# EAGLE design rover (EAGLE 9.6.2)
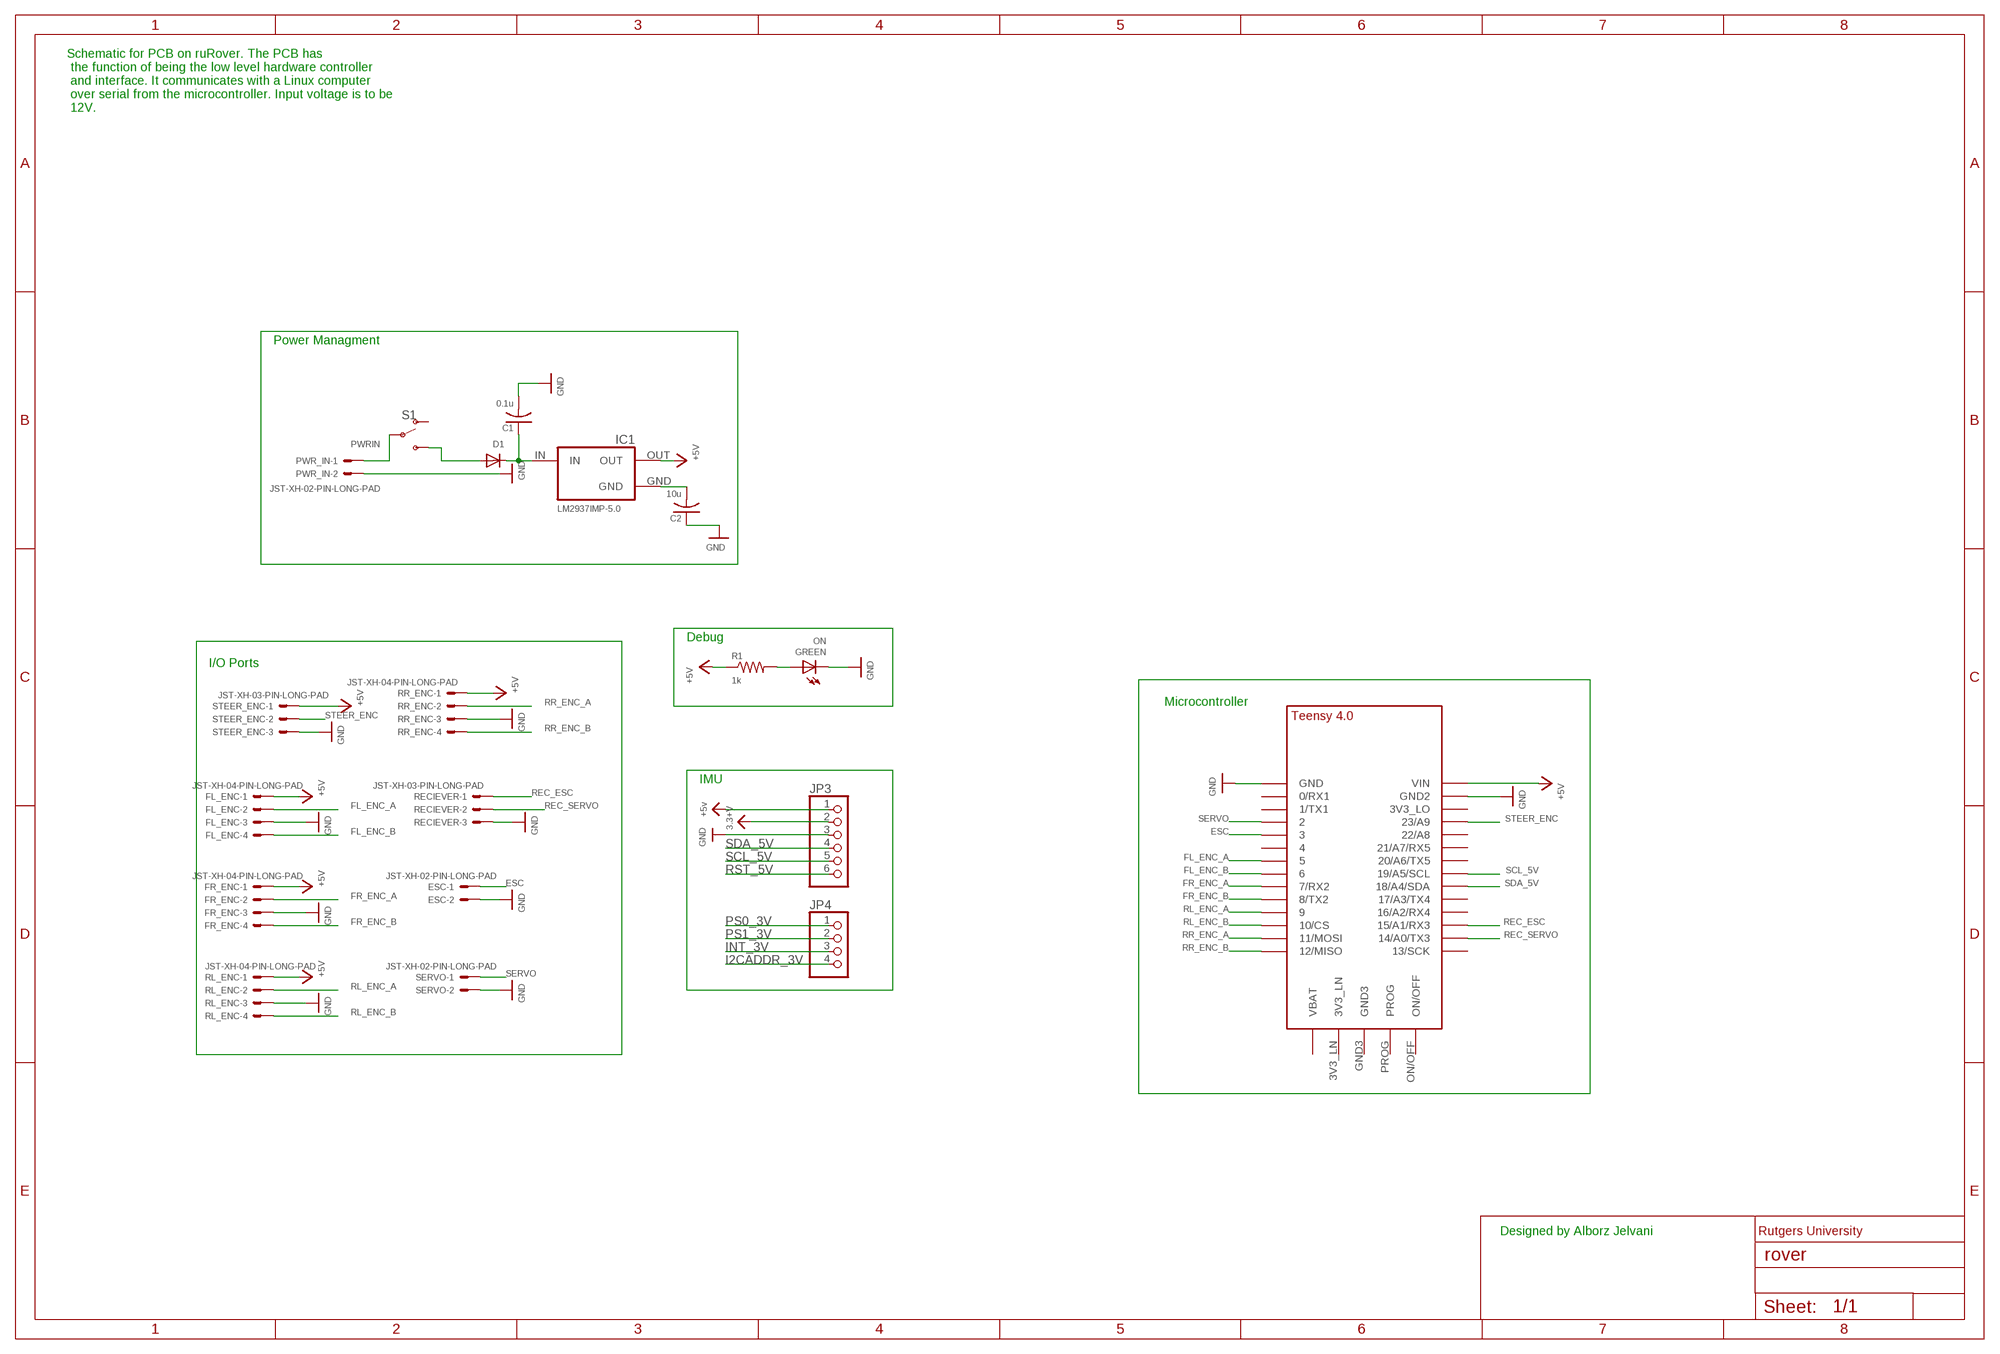
[diagram p0: schematic, sheet 1]

## Parts
C1  0.1u  C-USC1206  [C1206]
C2  10u  C-USC1206  [C1206]
D1  DIODESMA  [SMADIODE]
ESC  JST-XH-02-PIN-LONG-PAD  [JST-XH-02-PACKAGE-LONG-PAD]
FL_ENC  JST-XH-04-PIN-LONG-PAD  [JST-XH-04-PACKAGE-LONG-PAD]
FR_ENC  JST-XH-04-PIN-LONG-PAD  [JST-XH-04-PACKAGE-LONG-PAD]
GREEN  ON  LEDCHIP-LED0805  [CHIP-LED0805]
IC1  LM2937IMP-5.0  [SOT223]
JP3  HEADER-1X676MIL  [1X06_ROUND_76]
JP4  HEADER-1X476MIL  [1X04_ROUND_76]
PWR_IN  JST-XH-02-PIN-LONG-PAD  [JST-XH-02-PACKAGE-LONG-PAD]
R1  1k  R-US_R0603  [R0603]
RECIEVER  JST-XH-03-PIN-LONG-PAD  [JST-XH-03-PACKAGE-LONG-PAD]
RL_ENC  JST-XH-04-PIN-LONG-PAD  [JST-XH-04-PACKAGE-LONG-PAD]
RR_ENC  JST-XH-04-PIN-LONG-PAD  [JST-XH-04-PACKAGE-LONG-PAD]
S1  SWITCH-SPDT-SMD-AYZ0202  [SWITCH_DPDT_SMD_AYZ0202]
SERVO  JST-XH-02-PIN-LONG-PAD  [JST-XH-02-PACKAGE-LONG-PAD]
STEER_ENC  JST-XH-03-PIN-LONG-PAD  [JST-XH-03-PACKAGE-LONG-PAD]
U$5  TEENSY_4.0-BASIC  [TEENSY_4.0-BASIC]

## Nets
+3.3V: JP3.2 ; supply symbol labelled 3.3+V
+5V: FL_ENC.1 FR_ENC.1 IC1.OUT JP3.1 R1.1 RL_ENC.1 RR_ENC.1 STEER_ENC.1 U$5.VIN ; supply symbol labelled +5v
ESC: ESC.1 U$5.3/CANTX
FL_ENC_A: FL_ENC.2 U$5.5
FL_ENC_B: FL_ENC.4 U$5.6
FR_ENC_A: FR_ENC.2 U$5.7(7/RX2)
FR_ENC_B: FR_ENC.4 U$5.8(8/TX2)
GND: C1.2 C2.1 ESC.2 FL_ENC.3 FR_ENC.3 GREEN.C JP3.3 PWR_IN.2 RECIEVER.3 RL_ENC.3 RR_ENC.3 SERVO.2 STEER_ENC.3 U$5.GND U$5.GND2
I2CADDR_3V: JP4.4
INT_3V: JP4.3
N$1: GREEN.A R1.2
N$2: C1.1 D1.C IC1.IN
N$3: D1.A S1.3(S)
N$9: C2.2 IC1.GND
PS0_3V: JP4.1
PS1_3V: JP4.2
PWRIN: PWR_IN.1 S1.2(P)
REC_ESC: RECIEVER.1 U$5.15/A1(15/A1/RX3)
REC_SERVO: RECIEVER.2 U$5.14/A0(14/A0/TX3)
RL_ENC_A: RL_ENC.2 U$5.9/CS
RL_ENC_B: RL_ENC.4 U$5.10/CS
RR_ENC_A: RR_ENC.2 U$5.11/MOSI
RR_ENC_B: RR_ENC.4 U$5.12/MISO
RST_5V: JP3.6
SCL_5V: JP3.5 U$5.19/A5/SCL
SDA_5V: JP3.4 U$5.18/A4/SDA
SERVO: SERVO.1 U$5.2
STEER_ENC: STEER_ENC.2 U$5.23/A9
Unconnected: S1.1(O) U$5.0/RX(0/RX1) U$5.1/TX(1/TX1) U$5.3V3_LN U$5.3V3_LO U$5.4/CANRX U$5.13/SCK U$5.16/A2(16/A2/RX4) U$5.17/A3(17/A3/TX4) U$5.20/A6(20/A6/TX5) U$5.21/A7(21/A7/RX5) U$5.22/A8 U$5.GND3 U$5.ON/OFF U$5.PROG U$5.VBAT\(VBAT)

## Notes on the sheet
- Schematic for PCB on ruRover. The PCB has
   the function of being the low level hardware controller
   and interface. It communicates with a Linux computer
   over serial from the microcontroller. Input voltage is to be
   12V.
- Power Managment
- Debug
- I/O Ports
- Microcontroller
- IMU
- Designed by Alborz Jelvani | Rutgers University

## Power pins joined to a net without a drawn wire
GND: IC1.GND@(GND)

## Library data of the parts
C1 C2 = adafruit:C-US: CAPACITOR, American symbol; OC_NEWARK: unknown
D1 = adafruit:DIODE: Diode SMADIODE - SMA Surface Mount Package 20V 1A Schottky Diode Digikey: 641-1014-6-ND DO-1N4148 - Through Hole Small Current Diode SOD-123 20V 1 A (.5mV Vf) Schottky Diode - Digikey: MBRX120TPMSCT-ND SOD-323 10V 570mA (.38mV Vf, 3ns) Schottky Diode - Digikey: ZLLS410CT-ND SOD-523 30V 30mA Schottky Diode (RB751S-40TE61) - Digikey: RB751S-40TE61CT-ND SOT23-R/W - SOT23 Package (R = Solder Paste/Reflow Ovens, W = Hand-Soldering) BAT54Film 40V 300mA - Digikey: 497-7162-1-ND; OC_NEWARK: unknown
ESC PWR_IN SERVO = Rembrandt Electronics - JST XH Connectors v1-0:JST-XH-02-PIN: JST XH Connector 2 Pin Wire to board connector. Pitch: 2,54 mm, (0.100") Number of pins: 2 Created by Rembrandt Electronics www.rembrandtelectronics.com
FL_ENC FR_ENC RL_ENC RR_ENC = Rembrandt Electronics - JST XH Connectors v1-0:JST-XH-04-PIN: JST XH Connector 2 Pin Wire to board connector. Pitch: 2,54 mm, (0.100") Number of pins: 4 Created by Rembrandt Electronics www.rembrandtelectronics.com
GREEN = adafruit:LED: LED OSRAM: - CHIPLED LG R971, LG N971, LY N971, LG Q971, LY Q971, LO R971, LY R971 LH N974, LH R974 LS Q976, LO Q976, LY Q976 LO Q996 - Hyper CHIPLED LW Q18S LB Q993, LB Q99A, LB R99A - SideLED LS A670, LO A670, LY A670, LG A670, LP A670 LB A673, LV A673, LT A673, LW A673 LH A674 LY A675 LS A676, LA A676, LO A676, LY A676, LW A676 LS A679, LY A679, LG A679 - Hyper Micro SIDELED® LS Y876, LA Y876, LO Y876, LY Y876 LT Y87S - SmartLED LW L88C, LW L88S LB L89C, LB L89S, LG L890 LS L89K, LO L89K, LY L89K LS L896, LA L896, LO L896, LY L896 - TOPLED LS T670, LO T670, LY T670, LG T670, LP T670 LSG T670, LSP T670, LSY T670, LOP T670, LYG T670 LG T671, LOG T671, LSG T671 LB T673, LV T673, LT T673, LW T673 LH T674 LS T676, LA T676, LO T676, LY T676, LB T676, LH T676, LSB T676, LW T676 LB T67C, LV T67C, LT T67C, LS T67K, LO T67K, LY T67K, LW E67C LS E67B, LA E67B, LO E67B, LY E67B, LB E67C, LV E67C, LT E67C LW T67C LS T679, LY T679, LG T679 LS T770, LO T770, LY T770, LG T770, LP T770 LB T773, LV T773, LT T773, LW T773 LH T774 LS E675, LA E675, LY E675, LS T675 LS T776, LA T776, LO T776, LY T776, LB T776 LHGB T686 LT T68C, LB T68C - Hyper Mini TOPLED® LB M676 - Mini TOPLED Santana® LG M470 LS M47K, LO M47K, LY M47K Source: http://www.osram.convergy.de/; OC_NEWARK: unknown
IC1 = lm2937:LM2937IMP-*: 400 and 500 mA Low Dropout Voltage Regulator NATIONAL SEMICONDUCTOR created by Peter.Hofmann@ph-tronic.de <mailto:Reter.Hofmann@ph-tronic.de> 10-2004 Rev.0
JP3 = microbuilder:HEADER-1X6: PIN HEADER; OC_NEWARK: unknown
JP4 = microbuilder:HEADER-1X4: PIN HEADER; OC_NEWARK: unknown
R1 = adafruit:R-US_: RESISTOR, American symbol; OC_NEWARK: unknown
RECIEVER STEER_ENC = Rembrandt Electronics - JST XH Connectors v1-0:JST-XH-03-PIN: JST XH Connector 2 Pin Wire to board connector. Pitch: 2,54 mm, (0.100") Number of pins: 3 Created by Rembrandt Electronics www.rembrandtelectronics.com
S1 = SparkFun-Switches:SWITCH-SPDT: Single Pole, Double Throw (SPDT) Switch Single-pole, double-throw (SPDT) switch. Variant Overview SMD-AYZ0202 Surface Mount DPDT Switch <https://www.sparkfun.com/products/597> (COM-00597) Used on e.g. LilyPad Arduino USB - ATmega32U4 Board <https://www.sparkfun.com/products/12049> PTH-11.6X4.0MM SPDT Mini Power Switch <https://www.sparkfun.com/products/102> (COM-00102) Used on e.g. SparkFun Simon Says - Through-Hole Soldering Kit <https://www.sparkfun.com/products/10547> (KIT-10547) PTH-11.6X4.0MM-KIT KIT version of SPDT Mini Power Switch - Simplifies soldering by removing tStop of switch pins - only one side can be soldered. PTH-11.6X4.0MM-LOCK LOCK version of SPDT Mini Power Switch - Offset pins hold switch in place for easier soldering. SMD-RIGHT-ANGLE Surface Mount Right Angle Switch <https://www.sparkfun.com/products/10860> (COM-10860) Used on e.g. SparkFun ESP8266 Thing <https://www.sparkfun.com/products/13231>; OC_NEWARK: unknown; PROD_ID: SWCH-08179; SF_ID: COM-00597
U$5 = Teensy-4.0:TEENSY_4.0-BASIC; OC_NEWARK: unknown

## Board
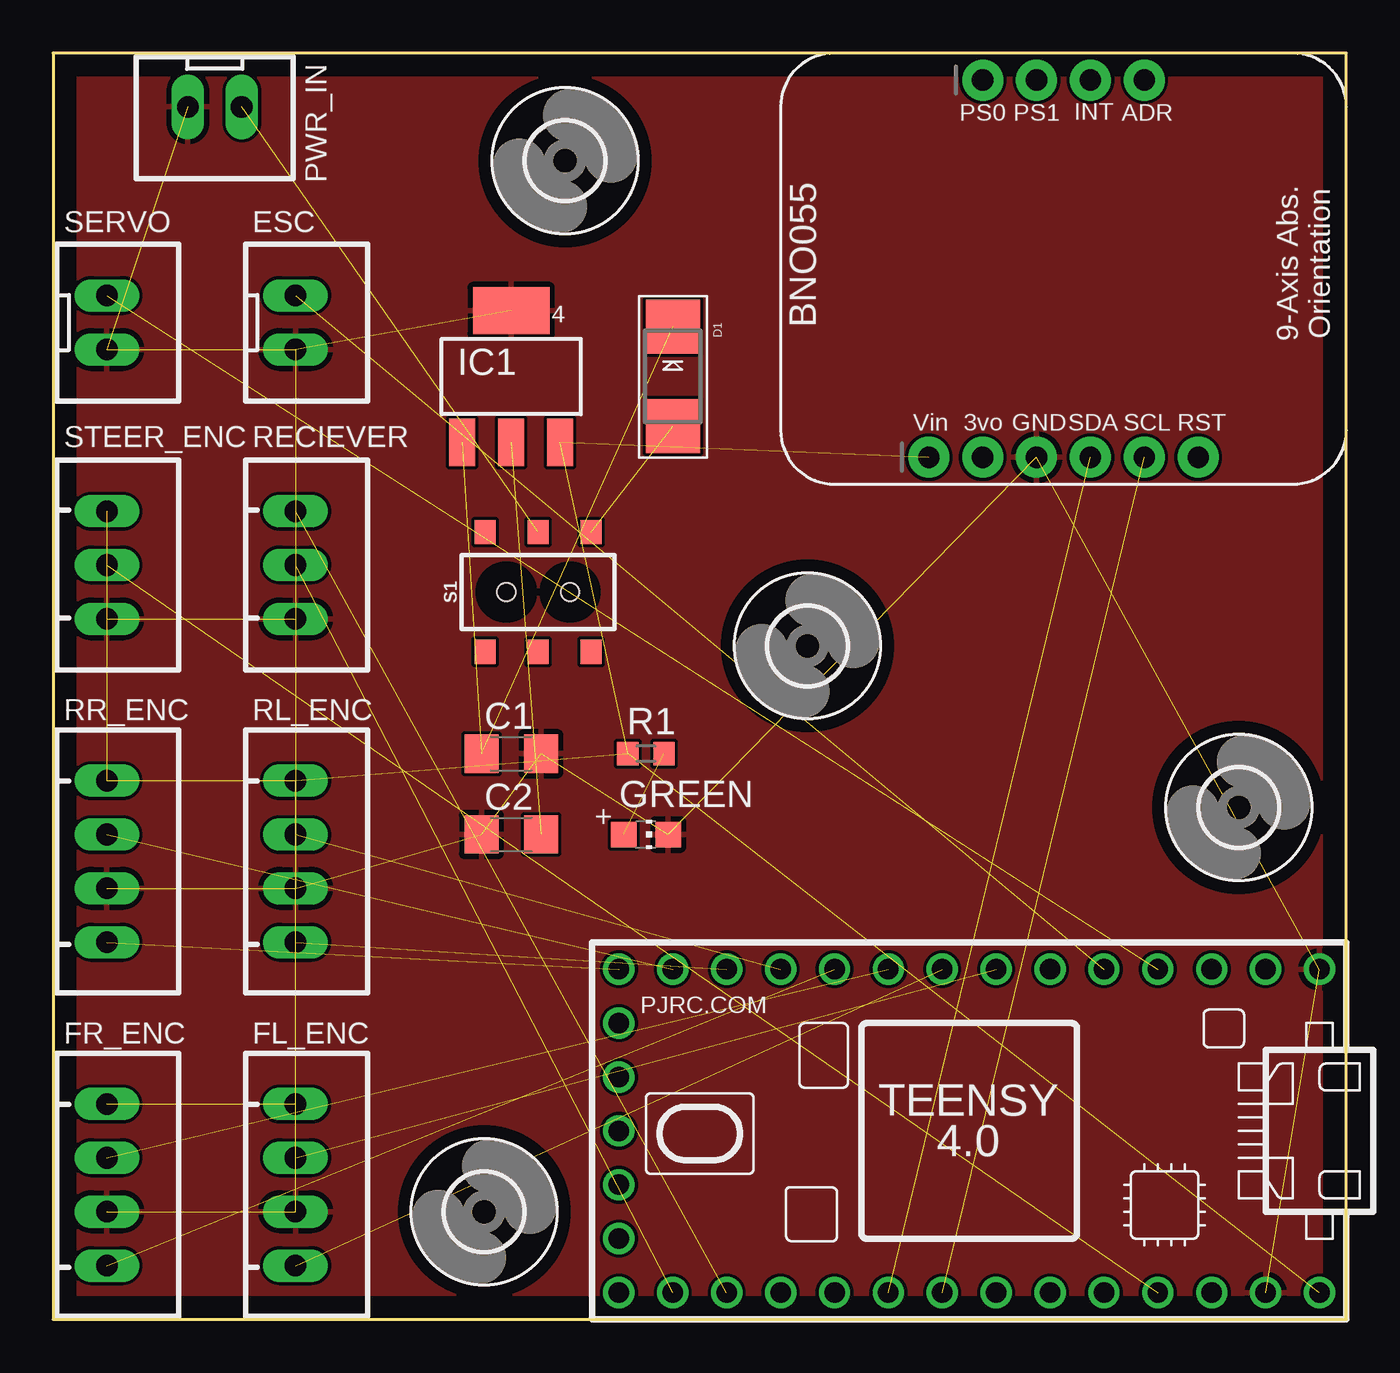
[diagram p1: board, top side]
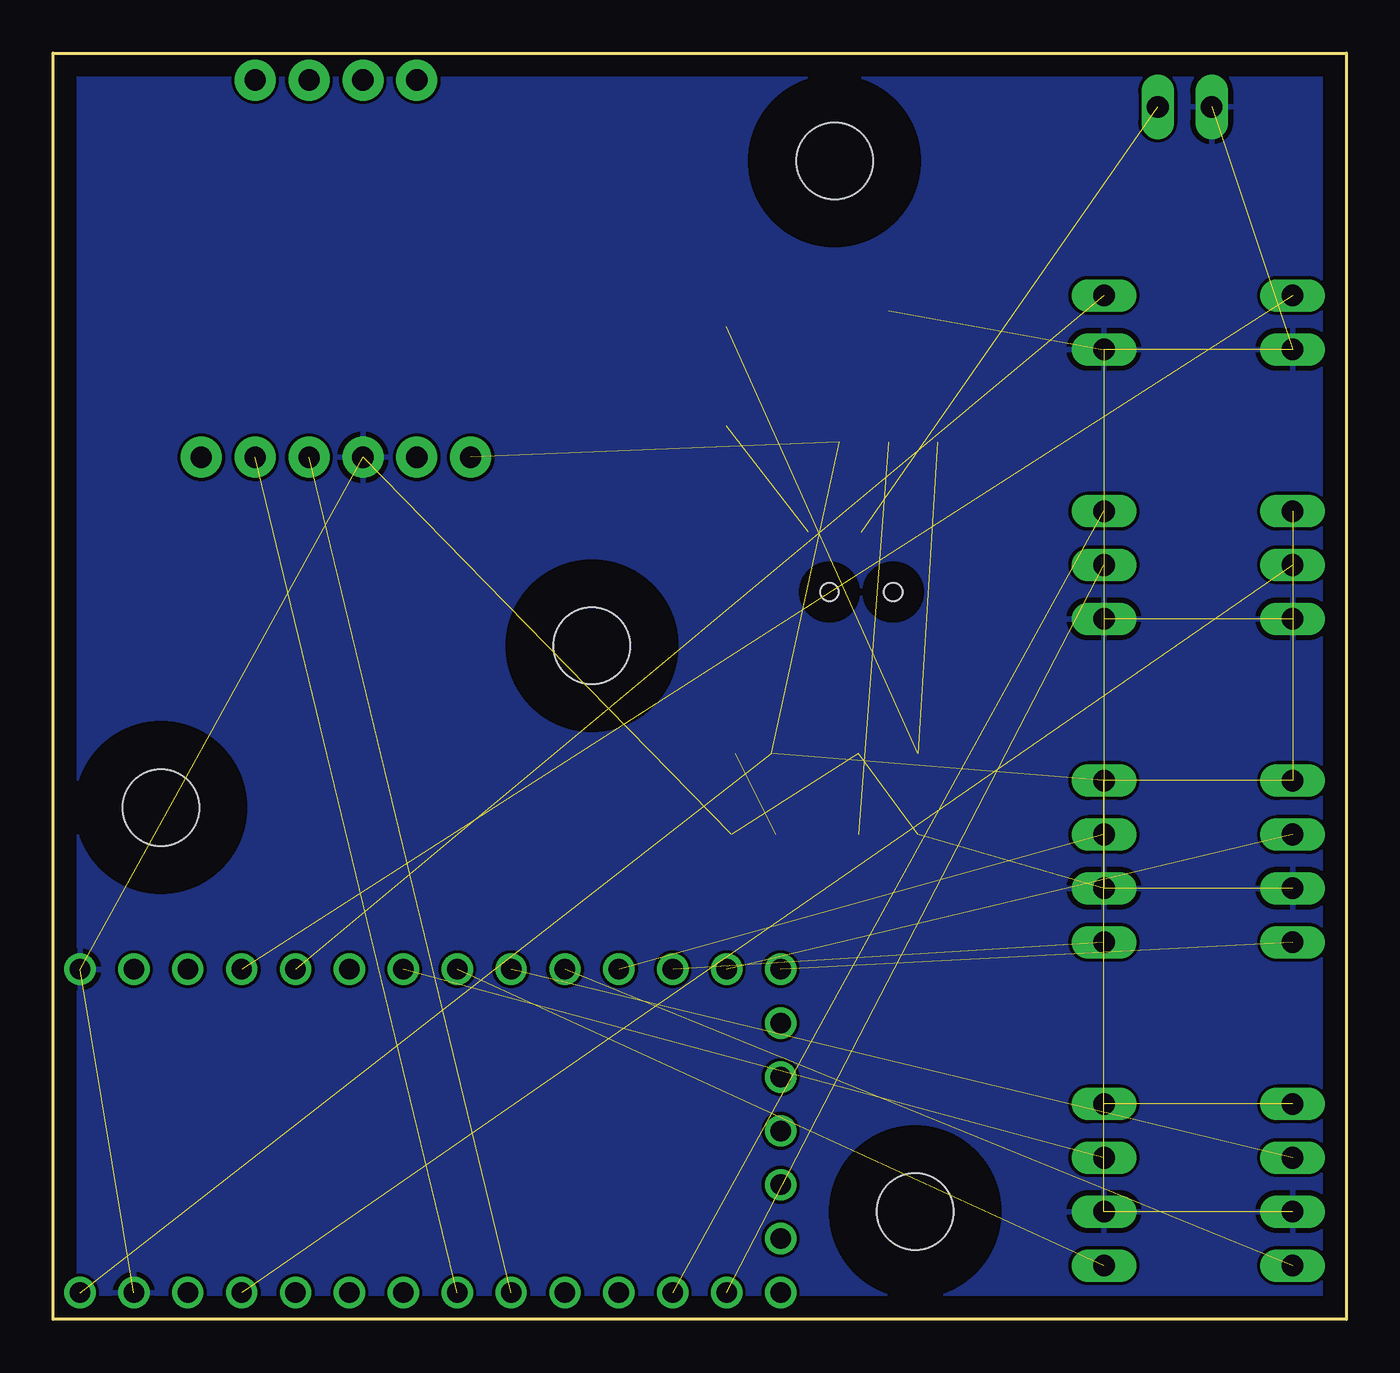
[diagram p2: board, bottom side, seen from below]

Size 60.96 x 59.69 mm. Coordinates in mm from the lower left corner, seen from the top.
Outline: 0,0 60.96,0 60.96,59.69 0,59.69 0,0
Copper layers (1*16): Top 0.035mm / dielectric 1.5mm / Bottom 0.035mm
Design rules "default": minimum track width 6mil, minimum drill 0.35mm, track to track 6mil, track to pad 6mil, pad to pad 6mil, via to via 6mil, smd to smd 6mil, copper to edge 40mil, drill to drill 6mil, minimum pad ring 10mil, minimum via ring 8mil, stop-mask expansion 4mil, vias tented up to drill 0mil, thermal gap 10mil

### Footprints (pad centres in the part's own frame; a part is rotated, then mirrored left to right if it is on the bottom)
C1206 = smd 1.6 x 1.8: 1 -1.4,0; 2 1.4,0
SMADIODE = smd 2.54 x 2.54: A 2.349,0; C -2.349,0
JST-XH-02-PACKAGE-LONG-PAD = drill 1.016 long: 1 -1.27,0; 2 1.27,0
JST-XH-04-PACKAGE-LONG-PAD = drill 1.016 long: 1 -3.81,0; 2 -1.27,0; 3 1.27,0; 4 3.81,0
CHIP-LED0805 = smd 1.2 x 1.2: A 0,-1.05; C 0,1.05
SOT223 = smd 1.219 x 2.235: GND 0,-3.099; IN -2.311,-3.099; OUT 2.311,-3.099 | smd 3.6 x 2.2: GND@ 0,3.099
1X06_ROUND_76 = drill 1 pad 1.93: 1 -6.35,0; 2 -3.81,0; 3 -1.27,0; 4 1.27,0; 5 3.81,0; 6 6.35,0
1X04_ROUND_76 = drill 1 pad 1.93: 1 -3.81,0; 2 -1.27,0; 3 1.27,0; 4 3.81,0
R0603 = smd 1 x 1.1: 1 -0.85,0; 2 0.85,0
JST-XH-03-PACKAGE-LONG-PAD = drill 1.016 long: 1 -2.54,0; 2 0,0; 3 2.54,0
SWITCH_DPDT_SMD_AYZ0202 = smd 1 x 1.15: 1 -2.5,2.825; 2 0,2.825; 3 2.5,2.825; 4 -2.5,-2.825; 5 0,-2.825; 6 2.5,-2.825 | hole 0.85: 1.5,0; -1.5,0
3,6 = hole 3.6: 0,0
TEENSY_4.0-BASIC = drill 0.965: 0/RX -13.97,-7.62; 1/TX -11.43,-7.62; 2 -8.89,-7.62; 3/CANTX -6.35,-7.62; 3V3_LN 16.51,-2.54; 3V3_LO -11.43,7.62; 4/CANRX -3.81,-7.62; 5 -1.27,-7.62; 6 1.27,-7.62; 7 3.81,-7.62; 8 6.35,-7.62; 9/CS 8.89,-7.62; 10/CS 11.43,-7.62; 11/MOSI 13.97,-7.62; 12/MISO 16.51,-7.62; 13/SCK 16.51,7.62; 14/A0 13.97,7.62; 15/A1 11.43,7.62; 16/A2 8.89,7.62; 17/A3 6.35,7.62; 18/A4/SDA 3.81,7.62; 19/A5/SCL 1.27,7.62; 20/A6 -1.27,7.62; 21/A7 -3.81,7.62; 22/A8 -6.35,7.62; 23/A9 -8.89,7.62; GND -16.51,-7.62; GND2 -13.97,7.62; GND3 16.51,0; ON/OFF 16.51,5.08; PROG 16.51,2.54; VBAT\ 16.51,-5.08; VIN -16.51,7.62

### Placement (x,y rotation side)
C1  21.59,26.67 0 top
C2  21.59,22.86 0 top
D1  29.21,44.45 270 top
ESC  11.43,46.99 270 top
FL_ENC  11.43,6.35 270 top
FR_ENC  2.54,6.35 270 top
GREEN  27.94,22.86 270 top
IC1  21.59,44.45 0 top
JP3  47.62,40.64 0 top
JP4  47.62,58.42 0 top
PWR_IN  7.62,57.15 180 top
R1  27.94,26.67 0 top
RECIEVER  11.43,35.56 270 top
RL_ENC  11.43,21.59 270 top
RR_ENC  2.54,21.59 270 top
S1  22.86,34.29 0 top
SERVO  2.54,46.99 270 top
STEER_ENC  2.54,35.56 270 top
U$4  [3,6]  35.56,31.75 0 top
U$5  43.18,8.89 180 top
U$6  [3,6]  20.32,5.08 0 top
U$7  [3,6]  24.13,54.61 0 top
U$8  [3,6]  55.88,24.13 0 top

### Tracks (layer width: path | path; a pad name or v marks a point on that pad's centre or on a via)
+5V  (8 unrouted)
ESC  (1 unrouted)
FL_ENC_A  (1 unrouted)
FL_ENC_B  (1 unrouted)
FR_ENC_A  (1 unrouted)
FR_ENC_B  (1 unrouted)
GND  (15 unrouted)
  pour Top (isolate 0.004): 0,59.69 0,0 60.96,0 60.96,59.69
  pour Bottom (isolate 0.004): 0,59.69 0,0 60.96,0 60.96,59.69
N$1  (1 unrouted)
N$2  (2 unrouted)
N$3  (1 unrouted)
N$9  (1 unrouted)
PWRIN  (1 unrouted)
REC_ESC  (1 unrouted)
REC_SERVO  (1 unrouted)
RL_ENC_A  (1 unrouted)
RL_ENC_B  (1 unrouted)
RR_ENC_A  (1 unrouted)
RR_ENC_B  (1 unrouted)
SCL_5V  (1 unrouted)
SDA_5V  (1 unrouted)
SERVO  (1 unrouted)
STEER_ENC  (1 unrouted)

### Text on the board
tPlace: PS0 | PS1 | INT | ADR | BNO055 | 9-Axis Abs. / Orientation | Vin | 3vo | GND | SDA | SCL | RST